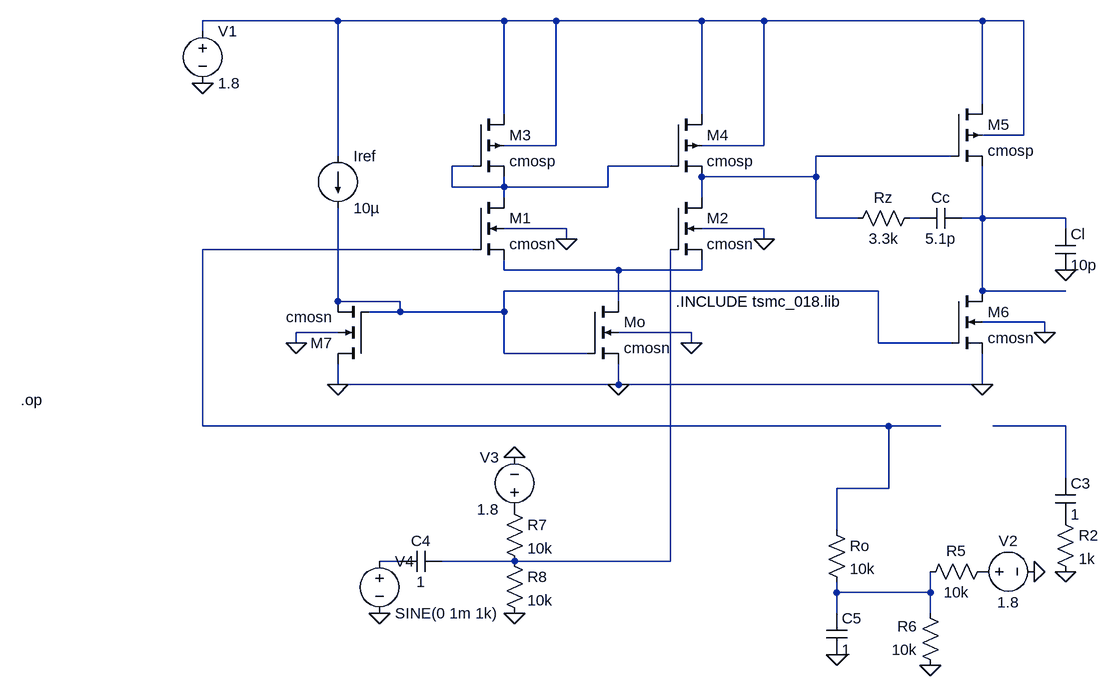
[diagram p0: schematic OTA_twostage_OL.asc]
OTA_twostage_OL.asc, the LTspice schematic file:
Version 4
SHEET 1 880 772
WIRE -1120 -240 -1328 -240
WIRE -864 -240 -1120 -240
WIRE -784 -240 -864 -240
WIRE -560 -240 -784 -240
WIRE -464 -240 -560 -240
WIRE -128 -240 -464 -240
WIRE -64 -240 -128 -240
WIRE -1328 -224 -1328 -240
WIRE -128 -112 -128 -240
WIRE -864 -96 -864 -240
WIRE -560 -96 -560 -240
WIRE -64 -64 -64 -240
WIRE -64 -64 -128 -64
WIRE -784 -48 -784 -240
WIRE -784 -48 -864 -48
WIRE -464 -48 -464 -240
WIRE -464 -48 -560 -48
WIRE -1120 -32 -1120 -240
WIRE -176 -32 -384 -32
WIRE -912 -16 -944 -16
WIRE -608 -16 -704 -16
WIRE -384 0 -384 -32
WIRE -384 0 -560 0
WIRE -944 16 -944 -16
WIRE -864 16 -864 0
WIRE -864 16 -944 16
WIRE -704 16 -704 -16
WIRE -704 16 -864 16
WIRE -864 32 -864 16
WIRE -560 32 -560 0
WIRE -384 64 -384 0
WIRE -320 64 -384 64
WIRE -224 64 -240 64
WIRE -128 64 -128 -16
WIRE -128 64 -160 64
WIRE 0 64 -128 64
WIRE -768 80 -864 80
WIRE -464 80 -560 80
WIRE 0 80 0 64
WIRE -768 96 -768 80
WIRE -464 96 -464 80
WIRE -912 112 -1328 112
WIRE -864 144 -864 128
WIRE -688 144 -864 144
WIRE -560 144 -560 128
WIRE -560 144 -688 144
WIRE -288 176 -864 176
WIRE -128 176 -128 64
WIRE 0 176 -128 176
WIRE -1120 192 -1120 48
WIRE -1024 192 -1120 192
WIRE -688 192 -688 144
WIRE -1024 208 -1024 192
WIRE -1024 208 -1072 208
WIRE -864 208 -864 176
WIRE -864 208 -1024 208
WIRE -32 224 -128 224
WIRE -1120 240 -1184 240
WIRE -576 240 -688 240
WIRE -32 240 -32 224
WIRE -1184 256 -1184 240
WIRE -576 256 -576 240
WIRE -288 256 -288 176
WIRE -176 256 -288 256
WIRE -864 272 -864 208
WIRE -736 272 -864 272
WIRE -1120 320 -1120 288
WIRE -688 320 -688 288
WIRE -688 320 -1120 320
WIRE -128 320 -128 272
WIRE -128 320 -688 320
WIRE -1328 384 -1328 112
WIRE -272 384 -1328 384
WIRE -192 384 -272 384
WIRE 0 384 -112 384
WIRE 0 464 0 384
WIRE -272 480 -272 384
WIRE -272 480 -352 480
WIRE -352 544 -352 480
WIRE -1024 592 -1056 592
WIRE -848 592 -960 592
WIRE -608 592 -608 112
WIRE -608 592 -848 592
WIRE -352 640 -352 624
WIRE -208 640 -208 608
WIRE -208 640 -352 640
WIRE -352 672 -352 640
WIRE -208 672 -208 640
FLAG -768 96 0
FLAG -464 96 0
FLAG -1184 256 0
FLAG -576 256 0
FLAG -32 240 0
FLAG 0 144 0
FLAG 0 608 0
FLAG -48 608 0
FLAG -208 752 0
FLAG -352 736 0
FLAG -1328 -144 0
FLAG -848 432 0
FLAG -848 672 0
FLAG -1056 672 0
FLAG -688 320 0
FLAG -1120 320 0
FLAG -128 320 0
SYMBOL nmos4 -912 32 R0
SYMATTR InstName M1
SYMATTR Value cmosn
SYMATTR Value2 l=1u w=15u
SYMBOL nmos4 -608 32 R0
SYMATTR InstName M2
SYMATTR Value cmosn
SYMATTR Value2 l=1u w=15u
SYMBOL pmos4 -912 -96 R0
SYMATTR InstName M3
SYMATTR Value cmosp
SYMATTR Value2 l=1u w=25u
SYMBOL pmos4 -608 -96 R0
SYMATTR InstName M4
SYMATTR Value cmosp
SYMATTR Value2 l=1u w=25u
SYMBOL voltage -1328 -240 R0
WINDOW 123 0 0 Left 2
WINDOW 39 0 0 Left 2
SYMATTR InstName V1
SYMATTR Value 1.8
SYMBOL nmos4 -736 192 R0
SYMATTR InstName Mo
SYMATTR Value cmosn
SYMATTR Value2 l=1u w=30u
SYMBOL nmos4 -1072 288 R180
SYMATTR InstName M7
SYMATTR Value cmosn
SYMATTR Value2 l=1u w=3u
SYMBOL nmos4 -176 176 R0
SYMATTR InstName M6
SYMATTR Value cmosn
SYMATTR Value2 l=1u w=30u
SYMBOL pmos4 -176 -112 R0
SYMATTR InstName M5
SYMATTR Value cmosp
SYMATTR Value2 l=1u w=50u
SYMBOL res -224 48 R90
WINDOW 0 0 56 VBottom 2
WINDOW 3 32 56 VTop 2
SYMATTR InstName Rz
SYMATTR Value 3.3k
SYMBOL cap -160 48 R90
WINDOW 0 0 32 VBottom 2
WINDOW 3 32 32 VTop 2
SYMATTR InstName Cc
SYMATTR Value 5.1p
SYMBOL cap -16 80 R0
SYMATTR InstName Cl
SYMATTR Value 10p
SYMBOL current -1120 -32 R0
WINDOW 123 0 0 Left 2
WINDOW 39 0 0 Left 2
SYMATTR InstName Iref
SYMATTR Value 10µ
SYMBOL cap -16 464 R0
SYMATTR InstName C3
SYMATTR Value 1
SYMBOL res -16 512 R0
SYMATTR InstName R2
SYMATTR Value 1k
SYMBOL res -368 528 R0
SYMATTR InstName Ro
SYMATTR Value 10k
SYMBOL cap -368 672 R0
SYMATTR InstName C5
SYMATTR Value 1
SYMBOL res -112 592 R90
WINDOW 0 0 56 VBottom 2
WINDOW 3 32 56 VTop 2
SYMATTR InstName R5
SYMATTR Value 10k
SYMBOL res -192 768 R180
WINDOW 0 36 76 Left 2
WINDOW 3 36 40 Left 2
SYMATTR InstName R6
SYMATTR Value 10k
SYMBOL voltage -144 608 R270
WINDOW 0 32 56 VTop 2
WINDOW 3 -32 56 VBottom 2
WINDOW 123 0 0 Left 2
WINDOW 39 0 0 Left 2
SYMATTR InstName V2
SYMATTR Value 1.8
SYMBOL res -864 496 R0
SYMATTR InstName R7
SYMATTR Value 10k
SYMBOL res -864 576 R0
SYMATTR InstName R8
SYMATTR Value 10k
SYMBOL voltage -848 528 R180
WINDOW 0 24 96 Left 2
WINDOW 3 24 16 Left 2
WINDOW 123 0 0 Left 2
WINDOW 39 0 0 Left 2
SYMATTR InstName V3
SYMATTR Value 1.8
SYMBOL cap -960 576 R90
WINDOW 0 0 32 VBottom 2
WINDOW 3 32 32 VTop 2
SYMATTR InstName C4
SYMATTR Value 1
SYMBOL voltage -1056 576 R0
WINDOW 123 0 0 Left 2
WINDOW 39 0 0 Left 2
SYMATTR InstName V4
SYMATTR Value SINE(0 1m 1k)
TEXT -600 192 Left 2 !.INCLUDE tsmc_018.lib
TEXT -1608 344 Left 2 !.op

The netlist it stands for:
* OTA_twostage_OL.asc
M1 N003 N006 N007 0 cmosn l=1u w=15u
M2 N002 N011 N007 0 cmosn l=1u w=15u
M3 N001 N003 N003 N001 cmosp l=1u w=25u
M4 N001 N003 N002 N001 cmosp l=1u w=25u
V1 N001 0 1.8
Mo N007 N008 0 0 cmosn l=1u w=30u
M7 0 N008 N008 0 cmosn l=1u w=3u
M6 N005 N008 0 0 cmosn l=1u w=30u
M5 N001 N002 N005 N001 cmosp l=1u w=50u
Rz N004 N002 3.3k
Cc N005 N004 5.1p
Cl N005 0 10p
Iref N001 N008 10µ
C3 N009 P001 1
R2 P001 0 1k
Ro N006 N012 10k
C5 N012 0 1
R5 P002 N012 10k
R6 0 N012 10k
V2 P002 0 1.8
R7 P003 N011 10k
R8 N011 0 10k
V3 P003 0 1.8
C4 N011 N010 1
V4 N010 0 SINE(0 1m 1k)
.model NMOS NMOS
.model PMOS PMOS
.lib standard.mos
.INCLUDE tsmc_018.lib
.op
.backanno
.end